# Altium schematic sheet LED_Board_Template.SchDoc: LED Board
size B; Date: MM/DD/YYYY; Author: LED Team; Organization: ORGANIZATION; Address1: ADDRESS 1; Address2: ADDRESS 2; Address3: ADDRESS 3; Address4: ADDRESS 4; Revision: -; SheetNumber: 1; SheetTotal: 3; ENG_APP_DATE: --/--/--; DSN_APP_DATE: --/--/--; CHK_APP_DATE: --/--/--
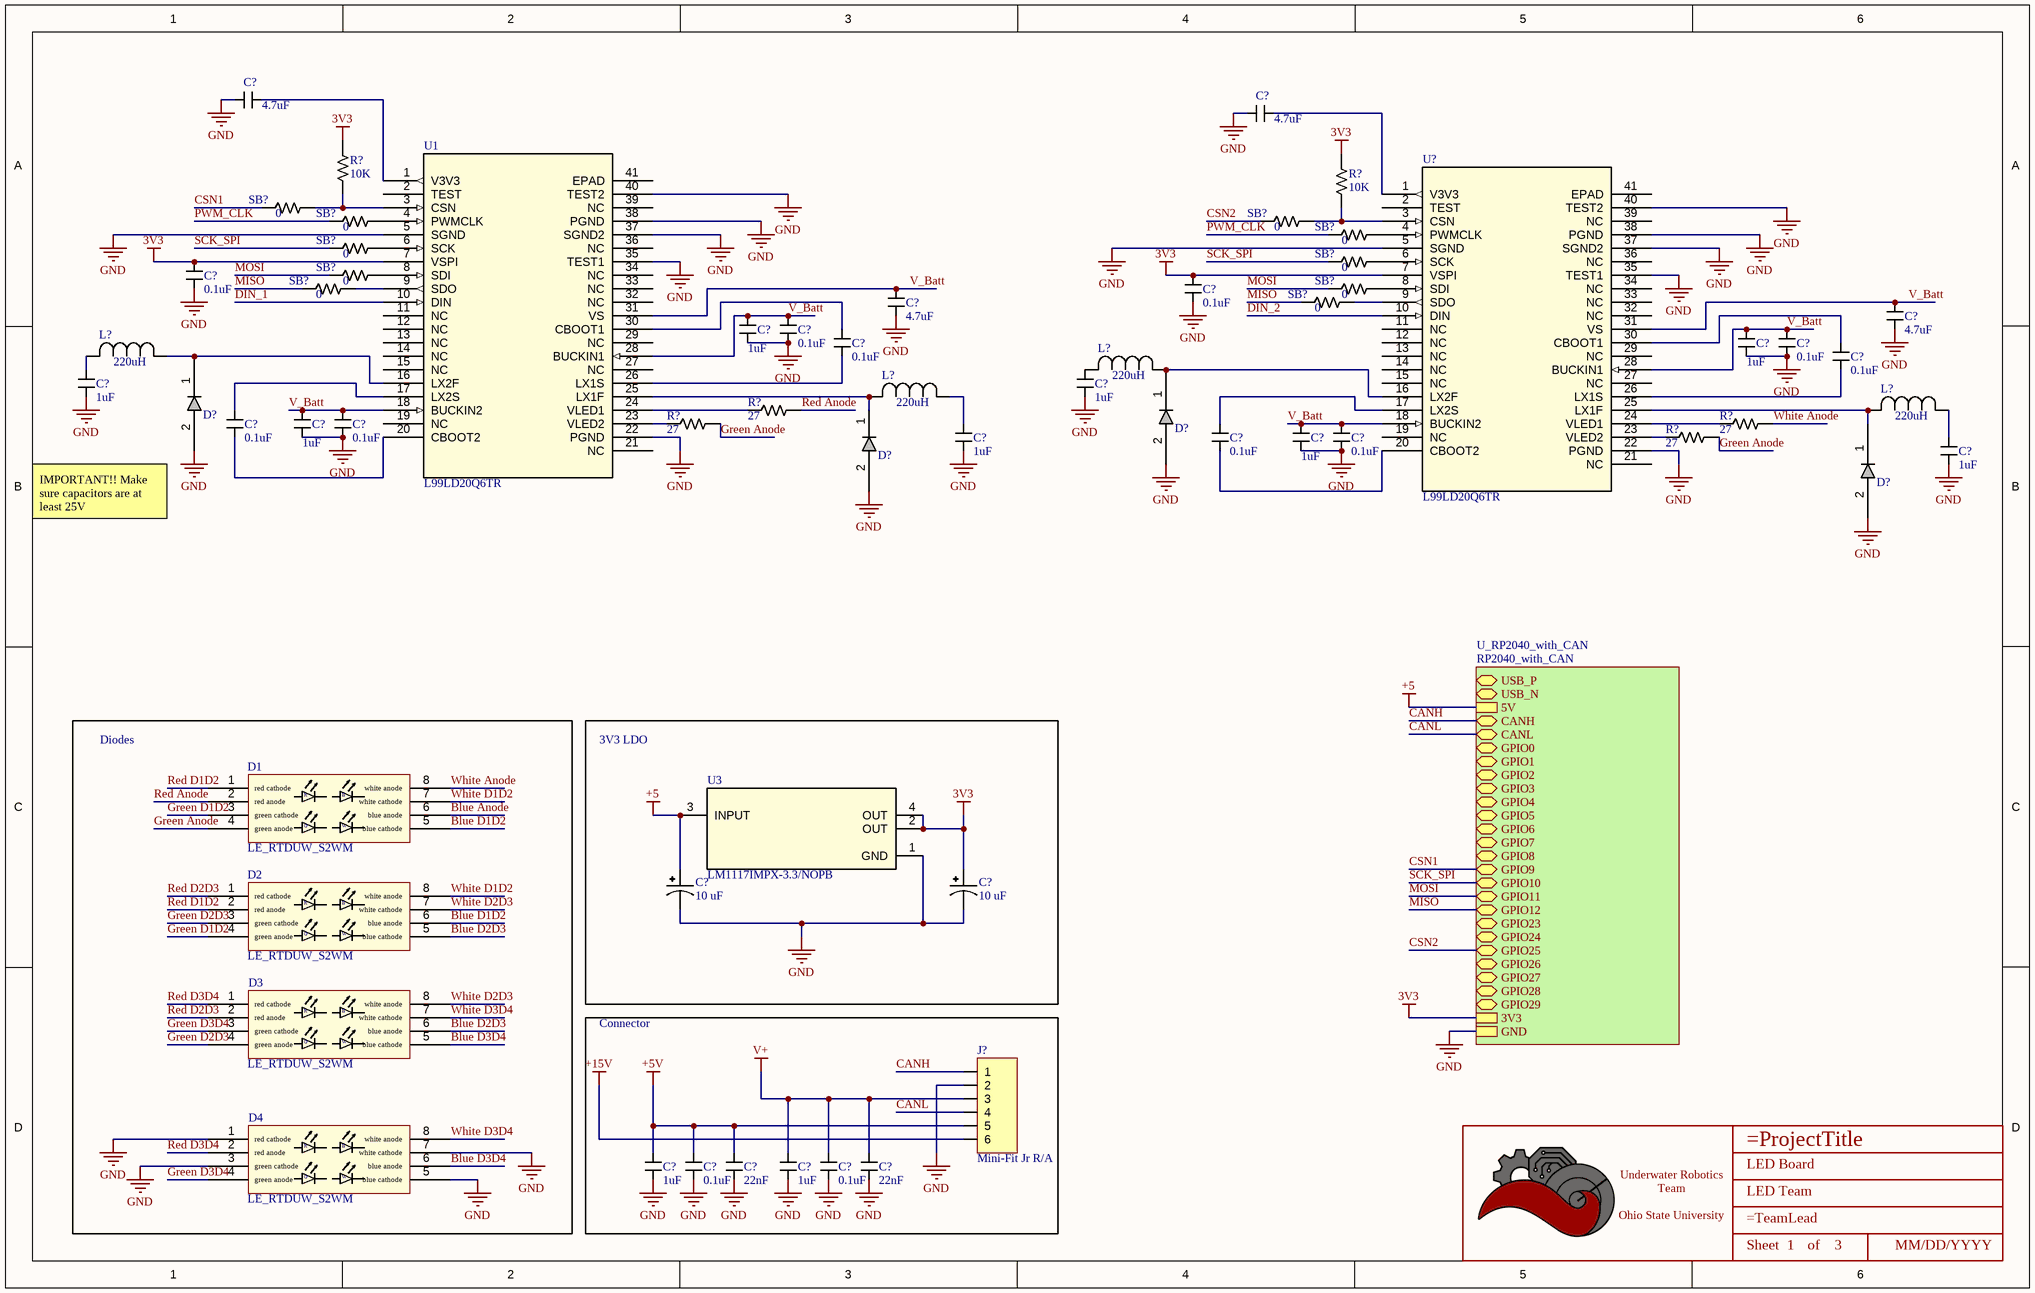
[diagram p0: LED_Board_Template.SchDoc]

## Parts
(Parts that share a designator on the sheet are numbered #1, #2 ... from top to bottom, then left to right.)
*  Title_Block  [LOGO]  (value not drawn)  (graphical)
C?#1  value 4.7uF  [CAPACITOR_0603]  (hidden comment: 4.7uF Ceramic 6.3V)
C?#2  value 4.7uF  [CAPACITOR_0603]  (hidden comment: 4.7uF Ceramic 6.3V)
C?#3  value 0.1uF  [CAPACITOR_0603]  (hidden comment: 100nF Ceramic 6.3V)
C?#4  value 0.1uF  [CAPACITOR_0603]  (hidden comment: 100nF Ceramic 6.3V)
C?#5  value 4.7uF  [CAPACITOR_0603]  (hidden comment: 4.7uF Ceramic 6.3V)
C?#6  value 4.7uF  [CAPACITOR_0603]  (hidden comment: 4.7uF Ceramic 6.3V)
C?#7  value 1uF  [CAPACITOR_0603]  (hidden comment: 1uF Ceramic 16V)
C?#8  value 0.1uF  [CAPACITOR_0805]  (hidden comment: 100nF Ceramic 50V)
C?#9  value 0.1uF  [CAPACITOR_0603]  (hidden comment: 100nF Ceramic 6.3V)
C?#10  value 1uF  [CAPACITOR_0603]  (hidden comment: 1uF Ceramic 16V)
C?#11  value 0.1uF  [CAPACITOR_0805]  (hidden comment: 100nF Ceramic 50V)
C?#12  value 0.1uF  [CAPACITOR_0603]  (hidden comment: 100nF Ceramic 6.3V)
C?#13  value 1uF  [CAPACITOR_0603]  (hidden comment: 1uF Ceramic 16V)
C?#14  value 1uF  [CAPACITOR_0603]  (hidden comment: 1uF Ceramic 16V)
C?#15  value 0.1uF  [CAPACITOR_0603]  (hidden comment: 100nF Ceramic 6.3V)
C?#16  value 1uF  [CAPACITOR_0603]  (hidden comment: 1uF Ceramic 16V)
C?#17  value 0.1uF  [CAPACITOR_0805]  (hidden comment: 100nF Ceramic 50V)
C?#18  value 1uF  [CAPACITOR_0603]  (hidden comment: 1uF Ceramic 16V)
C?#19  value 0.1uF  [CAPACITOR_0603]  (hidden comment: 100nF Ceramic 6.3V)
C?#20  value 1uF  [CAPACITOR_0603]  (hidden comment: 1uF Ceramic 16V)
C?#21  value 0.1uF  [CAPACITOR_0805]  (hidden comment: 100nF Ceramic 50V)
C?#22  value 1uF  [CAPACITOR_0603]  (hidden comment: 1uF Ceramic 16V)
C?#23  Value (uF): 10 uF  [CAPACITOR_1206 - POLAR]  (hidden comment: 10uF Tantalum 16V)
C?#24  Value (uF): 10 uF  [CAPACITOR_1206 - POLAR]  (hidden comment: 10uF Tantalum 16V)
C?#25  value 1uF  [CAPACITOR_0603]  (hidden comment: 1uF Ceramic 16V)
C?#26  value 0.1uF  [CAPACITOR_0805]  (hidden comment: 100nF Ceramic 50V)
C?#27  value 22nF  [CAPACITOR_0402]  (hidden comment: 22nF Ceramic 25V)
C?#28  value 1uF  [CAPACITOR_0603]  (hidden comment: 1uF Ceramic 16V)
C?#29  value 0.1uF  [CAPACITOR_0805]  (hidden comment: 100nF Ceramic 50V)
C?#30  value 22nF  [CAPACITOR_0402]  (hidden comment: 22nF Ceramic 25V)
D1  LE_RTDUW_S2WM
D2  LE_RTDUW_S2WM
D3  LE_RTDUW_S2WM
D4  LE_RTDUW_S2WM
D?#1  CCS15S40,L3F  [SOD-963   CST2C_TOS]  (value not drawn)
D?#2  CCS15S40,L3F  [SOD-963   CST2C_TOS]  (value not drawn)
D?#3  CCS15S40,L3F  [SOD-963   CST2C_TOS]  (value not drawn)
D?#4  CCS15S40,L3F  [SOD-963   CST2C_TOS]  (value not drawn)
J?  Mini-Fit Jr R/A  [CONN_MOLEX_MINIFIT JR_6 POS_R/A]
L?#1  SRR1280-221K  [IND_BOURNS_SRR1280]  (value not drawn)
L?#2  SRR1280-221K  [IND_BOURNS_SRR1280]  (value not drawn)
L?#3  SRR1280-221K  [IND_BOURNS_SRR1280]  (value not drawn)
L?#4  SRR1280-221K  [IND_BOURNS_SRR1280]  (value not drawn)
R?#1  Value  (Ohms): 10K  [RESISTOR_0402]  (hidden comment: 10k Ohm 1% 1/16W)
R?#2  Value  (Ohms): 10K  [RESISTOR_0402]  (hidden comment: 10k Ohm 1% 1/16W)
R?#3  Value  (Ohms): 27  [RESISTOR_0603]  (hidden comment: 27 Ohm 5% 1/8W)
R?#4  Value  (Ohms): 27  [RESISTOR_0603]  (hidden comment: 27 Ohm 5% 1/8W)
R?#5  Value  (Ohms): 27  [RESISTOR_0603]  (hidden comment: 27 Ohm 5% 1/8W)
R?#6  Value  (Ohms): 27  [RESISTOR_0603]  (hidden comment: 27 Ohm 5% 1/8W)
SB?#1  Value  (Ohms): 0  [RESISTOR_0603]  (hidden comment: 0 Ohm Jumper No Fit)
SB?#2  Value  (Ohms): 0  [RESISTOR_0603]  (hidden comment: 0 Ohm Jumper No Fit)
SB?#3  Value  (Ohms): 0  [RESISTOR_0603]  (hidden comment: 0 Ohm Jumper No Fit)
SB?#4  Value  (Ohms): 0  [RESISTOR_0603]  (hidden comment: 0 Ohm Jumper No Fit)
SB?#5  Value  (Ohms): 0  [RESISTOR_0603]  (hidden comment: 0 Ohm Jumper No Fit)
SB?#6  Value  (Ohms): 0  [RESISTOR_0603]  (hidden comment: 0 Ohm Jumper No Fit)
SB?#7  Value  (Ohms): 0  [RESISTOR_0603]  (hidden comment: 0 Ohm Jumper No Fit)
SB?#8  Value  (Ohms): 0  [RESISTOR_0603]  (hidden comment: 0 Ohm Jumper No Fit)
SB?#9  Value  (Ohms): 0  [RESISTOR_0603]  (hidden comment: 0 Ohm Jumper No Fit)
SB?#10  Value  (Ohms): 0  [RESISTOR_0603]  (hidden comment: 0 Ohm Jumper No Fit)
U1  L99LD20Q6TR  [QFN40L_6P15X6P15X0P5_STM]
U3  LM1117IMPX-3.3/NOPB  [SOT-223-4]
U?  L99LD20Q6TR  [QFN40L_6P15X6P15X0P5_STM]

## Blocks framed on the sheet
Diodes: D1-D4
3V3 LDO: C?#23 C?#24 U3
Connector: C?#25-C?#30 J?

## Sub-sheets
U_RP2040_with_CAN = RP2040_with_CAN: USB_P (bidir), USB_N (bidir), 5V, CANH (bidir), CANL (bidir), GPIO0 (bidir), GPIO1 (bidir), GPIO2 (bidir), GPIO3 (bidir), GPIO4 (bidir), GPIO5 (bidir), GPIO6 (bidir), GPIO7 (bidir), GPIO8 (bidir), GPIO9 (bidir), GPIO10 (bidir), GPIO11 (bidir), GPIO12 (bidir), GPIO23 (bidir), GPIO24 (bidir), GPIO25 (bidir), GPIO26 (bidir), GPIO27 (bidir), GPIO28 (bidir), GPIO29 (bidir), 3V3, GND

## Nets
3V3: C?#3.1 C?#4.1 C?#24.1 R?#1.1 R?#2.1 U1.7(VSPI) U3.2(OUT) U3.4(OUT) U?.7(VSPI) ; sheet U_RP2040_with_CAN/3V3
+5: C?#23.1 U3.3(INPUT) ; sheet U_RP2040_with_CAN/5V
+5V: C?#25.1 C?#26.1 C?#27.1 J?.5
+15V: J?.6
GND: C?#1.2 C?#2.2 C?#3.2 C?#4.2 C?#5.1 C?#6.1 C?#7.2 C?#8.2 C?#10.2 C?#11.2 C?#13.2 C?#14.2 C?#16.2 C?#17.2 C?#18.2 C?#20.2 C?#21.2 C?#22.2 C?#23.2 C?#24.2 C?#25.2 C?#26.2 C?#27.2 C?#28.2 C?#29.2 C?#30.2 D4.1(red_cathode) D4.3(green_cathode) D4.5(blue_cathode) D4.7(white_cathode) D?#1.2 D?#2.2 D?#3.2 D?#4.2 J?.2 U1.5(SGND) U1.22(PGND) U1.35(TEST1) U1.37(SGND2) U1.38(PGND) U1.40(TEST2) U3.1(GND) U?.5(SGND) U?.22(PGND) U?.35(TEST1) U?.37(SGND2) U?.38(PGND) U?.40(TEST2) ; sheet U_RP2040_with_CAN/GND
V+: C?#28.1 C?#29.1 C?#30.1 J?.3
Blue Anode: D1.6(blue_anode)
Blue D1D2: D1.5(blue_cathode) D2.6(blue_anode)
Blue D2D3: D2.5(blue_cathode) D3.6(blue_anode)
Blue D3D4: D3.5(blue_cathode) D4.6(blue_anode)
CANH: J?.1 ; sheet U_RP2040_with_CAN/CANH
CANL: J?.4 ; sheet U_RP2040_with_CAN/CANL
CSN1: SB?#1.2 ; sheet U_RP2040_with_CAN/GPIO9
CSN2: SB?#3.2 ; sheet U_RP2040_with_CAN/GPIO25
DIN_1: U1.10(DIN)
DIN_2: U?.10(DIN)
Green Anode: D1.4(green_anode) R?#4.1 R?#6.1
Green D1D2: D1.3(green_cathode) D2.4(green_anode)
Green D2D3: D2.3(green_cathode) D3.4(green_anode)
Green D3D4: D3.3(green_cathode) D4.4(green_anode)
MISO: SB?#8.2 SB?#10.2 ; sheet U_RP2040_with_CAN/GPIO12
MOSI: SB?#7.2 SB?#9.2 ; sheet U_RP2040_with_CAN/GPIO11
PWM_CLK: SB?#2.2 SB?#4.2
Red Anode: D1.2(red_anode) R?#3.1
Red D1D2: D1.1(red_cathode) D2.2(red_anode)
Red D2D3: D2.1(red_cathode) D3.2(red_anode)
Red D3D4: D3.1(red_cathode) D4.2(red_anode)
SCK_SPI: SB?#5.2 SB?#6.2 ; sheet U_RP2040_with_CAN/GPIO10
V_Batt: C?#5.2 C?#6.2 C?#7.1 C?#8.1 C?#10.1 C?#11.1 C?#16.1 C?#17.1 C?#20.1 C?#21.1 U1.18(BUCKIN2) U1.28(BUCKIN1) U1.31(VS) U?.18(BUCKIN2) U?.28(BUCKIN1) U?.31(VS)
White Anode: D1.8(white_anode) R?#5.1
White D1D2: D1.7(white_cathode) D2.8(white_anode)
White D2D3: D2.7(white_cathode) D3.8(white_anode)
White D3D4: D3.7(white_cathode) D4.8(white_anode)
NetC?#1_1: C?#1.1 U1.1(V3V3)
NetC?#2_1: C?#2.1 U?.1(V3V3)
NetC?#9_1: C?#9.1 U1.30(CBOOT1)
NetC?#9_2: C?#9.2 U1.26(LX1S)
NetC?#12_1: C?#12.1 U?.30(CBOOT1)
NetC?#12_2: C?#12.2 U?.26(LX1S)
NetC?#13_1: C?#13.1 L?#1.2
NetC?#14_1: C?#14.1 L?#2.2
NetC?#15_1: C?#15.1 U1.17(LX2S)
NetC?#15_2: C?#15.2 U1.20(CBOOT2)
NetC?#18_1: C?#18.1 L?#3.1
NetC?#19_1: C?#19.1 U?.17(LX2S)
NetC?#19_2: C?#19.2 U?.20(CBOOT2)
NetC?#22_1: C?#22.1 L?#4.1
NetD?#1_1: D?#1.1 L?#1.1 U1.16(LX2F)
NetD?#2_1: D?#2.1 L?#2.1 U?.16(LX2F)
NetD?#3_1: D?#3.1 L?#3.2 U1.25(LX1F)
NetD?#4_1: D?#4.1 L?#4.2 U?.25(LX1F)
NetR?#1_2: R?#1.2 SB?#1.1 U1.3(CSN)
NetR?#2_2: R?#2.2 SB?#3.1 U?.3(CSN)
NetR?#3_2: R?#3.2 U1.24(VLED1)
NetR?#4_2: R?#4.2 U1.23(VLED2)
NetR?#5_2: R?#5.2 U?.24(VLED1)
NetR?#6_2: R?#6.2 U?.23(VLED2)
NetSB?#2_1: SB?#2.1 U1.4(PWMCLK)
NetSB?#4_1: SB?#4.1 U?.4(PWMCLK)
NetSB?#5_1: SB?#5.1 U1.6(SCK)
NetSB?#6_1: SB?#6.1 U?.6(SCK)
NetSB?#7_1: SB?#7.1 U1.8(SDI)
NetSB?#8_1: SB?#8.1 U1.9(SDO)
NetSB?#9_1: SB?#9.1 U?.8(SDI)
NetSB?#10_1: SB?#10.1 U?.9(SDO)

Not connected (* = marked no-connect by the designer): U1 2(TEST) 11(NC) 12(NC) 13(NC) 14(NC) 15(NC) 19(NC) 21(NC) 27(NC) 29(NC) 32(NC) 33(NC) 34(NC) 36(NC) 39(NC) 41(EPAD); U? 2(TEST) 11(NC) 12(NC) 13(NC) 14(NC) 15(NC) 19(NC) 21(NC) 27(NC) 29(NC) 32(NC) 33(NC) 34(NC) 36(NC) 39(NC) 41(EPAD)

## Notes on the sheet
- IMPORTANT!! Make sure capacitors are at least 25V
- DWG. NO.
- REV.
- SHT.
- THIS DOCUMENT AND THE DATA DISCLOSED HEREIN OR HEREWITH IS THE PROPERTY OF ALTIUM LIMITED AND MAY BE FREELY DISTRIBUTED IN WHOLE. NO RIGHTS ARE RESERVED OR EXPRESS OR IMPLIED WARANTEE GIVEN.
- REVISION
- DESCRIPTION
- DATE
- APPROVED
- ENG:
- APPROVALS
- PROJECT
- DSN:
- CHK:
- REFERENCE DOCUMENTS
- PROJECT REVISION:
- TITLE
- DOCUMENT REVISION:
- DESIGN ITEM:
- BOM:
- FAB DWG:
- PCB DWG:
- ASSY DWG:
- SCALE:
- SIZE
- B
- CAGE CODE
- FILE NAME
- DWG NO.
- SHEET
- OF
- REV
- (in symbol INDUCTOR_SRR1280-221K) 220uH
- (in symbol LE_RTDUW_S2WM) R; B; G; W
- (in symbol Title_Block) Underwater Robotics Team / Ohio State University; Sheet; of

## Library data of the parts
* = Title_Block: UWRT Schematic Title Block Template / Created June 2021, Dylan Trainor
C?#1 C?#2 C?#5 C?#6 = CAPACITOR_4.7uF_0603: Cap 4.7uF 6.3V +/-10% / Ceramic 0603; Made By: Robert Pafford; Tolerance: +/- 10%; Voltage: 6.3V; Supplier 1: Digi-Key; Supplier Part Number 1: 1276-2087-1-ND
C?#3 C?#4 C?#9 C?#12 C?#15 C?#19 = CAPACITOR_0.1uF_0603_1: Cap 100nF 6.3V +/-10% / Ceramic 0603; Made By: Flip B; ComponentLink1Description: Datsheet; ComponentLink1URL: https://www.mouser.com/datasheet/2/212/KEM_C1002_X7R_SMD-1102033.pdf; Tolerance: +/- 10%; Voltage: 6.3V; Supplier 1: Digi-Key; Supplier Part Number 1: 399-15351-1-ND
C?#7 C?#10 C?#13 C?#14 C?#16 C?#18 C?#20 C?#22 C?#25 C?#28 = CAPACITOR_1uF_0603: Cap 1uF 16V +/-10% / Ceramic 0603; Made By: Flip B; Tolerance: +/- 10%; Voltage: 16V; Supplier 1: Digi-Key; Supplier Part Number 1: 399-7847-1-ND
C?#8 C?#11 C?#17 C?#21 C?#26 C?#29 = CAPACITOR_0.1uF_0805: Cap 100nF 50V +/-10% / Ceramic 0805; Made By: Robert Pafford; Tolerance: +/- 10%; Voltage: 50V; Supplier 1: Newark; Supplier Part Number 1: 38AH3645
C?#23 C?#24 = CAPACITOR_10uF_1206_Tantalum_1: Cap 10uF 16V +/-20% / Tantalum 1206; Tolerance: +/- 10%; Made By: Dylan T; ComponentLink1Description: Digikey; ComponentLink1URL: https://www.digikey.com/en/products/detail/kyocera-avx/F981A106MMA/4004990; Voltage: 16V; Supplier 1: Newark; Supplier Part Number 1: 26AC4143
C?#27 C?#30 = CAPACITOR_0.022uF_0402: Cap 22nF 25V +/-10% / Ceramic 0402; Made By: Robert Pafford; Tolerance: +/- 10%; Voltage: 25V; Supplier 1: Digi-Key; Supplier Part Number 1: 445-1261-1-ND
D1-D4 = LE_RTDUW_S2WM: LED OSTAR RGBW 625/527/453NM SMD; Designator: D; Supplier 1: Mouser; Supplier Part Number 1: 720-LERTDUWS2WMA2120
D?#1-D?#4 = SCHOTTKY_40V_1.5A: DIODE SCHOTTKY 40V 1.5A CST2C; Mfr_Name: Toshiba Electronic Devices & Storage Corp.; Type: DEV; Copyright: Copyright (C) 2023 Ultra Librarian. All rights reserved.; Manufacturer_Part_Number: CCS15S40,L3F; RefDes: RefDes; Supplier 1: Digi-Key; Supplier Part Number 1: CCS15S40L3FCT-ND
J? = CONN_MOLEX_MINIFIT JR_6POS_R/A: Molex Minifit Jr. 5569 / 6 Pos R/A Natural; Pitch: 4.2mm; Configuration: Right Angle; Current Per Pin: 13A; Number of Positions: 8; Manufacturer: Molex; Color: Natural; Created By: Flip B; ComponentLink1Description: Datasheet; ComponentLink1URL: https://www.molex.com/pdm_docs/ps/PS-5556-001.pdf; Series: Minifit Jr 5569; Supplier 1: Digi-Key; Supplier Part Number 1: WM1353-ND
L?#1-L?#4 = INDUCTOR_SRR1280-221K: 220 µH Shielded Drum Core, Wirewound Inductor 1.6 A 400mOhm Max Nonstandard; Mfr_Name: Bourns Electronics; Type: DEV; Copyright: Copyright (C) 2023 Ultra Librarian. All rights reserved.; Manufacturer_Part_Number: SRR1280-221K; RefDes: RefDes; Supplier 1: Digi-Key; Supplier Part Number 1: SRR1280-221KLCT-ND
R?#1 R?#2 = RESISTOR_10K_0402: RES 10k OHM 1% 1/16W 0402; Tolerance: +/- 1%; Made By: Robert Pafford; Wattage: 1/16W; Supplier: Digikey; Digikey Part Numer: CR0603-JW-104ELFTR-ND; Supplier 1: Digi-Key; Supplier Part Number 1: YAG3436CT-ND
R?#3-R?#6 = RESISTOR_27_0603: RES 27 OHM 5% 1/8W 0603; Tolerance: +/- 5%; Made By: Robert Pafford; ComponentLink1Description: Datasheet; ComponentLink1URL: https://www.bourns.com/docs/product-datasheets/CRxxxxx.pdf; Wattage: 1/8W; Supplier: Digikey; Digikey Part Numer: CR0603-JW-104ELFTR-ND; Supplier 1: Digi-Key; Supplier Part Number 1: 2019-RK73B1JTTD270JCT-ND
SB?#1-SB?#10 = JUMPER_0_0603: 0 Ohm Jumper No Fit for Solder Bridge; Made By: Robert Pafford; ComponentLink1Description: Digikey; ComponentLink1URL: https://www.digikey.com/en/products/detail/koa-speer-electronics-inc/RK73B1JTTD101J/9844701
U1 U? = L99LD20Q6TR: IC LED DRVR RGLTR PWM 1.5A 40QFN; Mfr_Name: STMicroelectronics; Copyright: Copyright (C) 2023 Ultra Librarian. All rights reserved.; Manufacturer_Part_Number: L99LD20Q6TR; RefDes: RefDes; Type: DEV; Supplier 1: Digi-Key; Supplier Part Number 1: 497-18126-1-ND
U3 = LM1117IMPX-3.3/NOPB: IC REG LIN 3.3V 800MA SOT223-4; PartNumber: LM1117IMP-3.3/NOPB; Manufacturer: Texas Instruments; Vin (Max): 15V; Supplier 1: Digi-Key; Supplier Part Number 1: LM1117IMPX-3.3/NOPBCT-ND; Vout (Min/Fixed): 3.3V; Amp Out: 800mA; Package: SOT-223-4; Created By: Dylan T